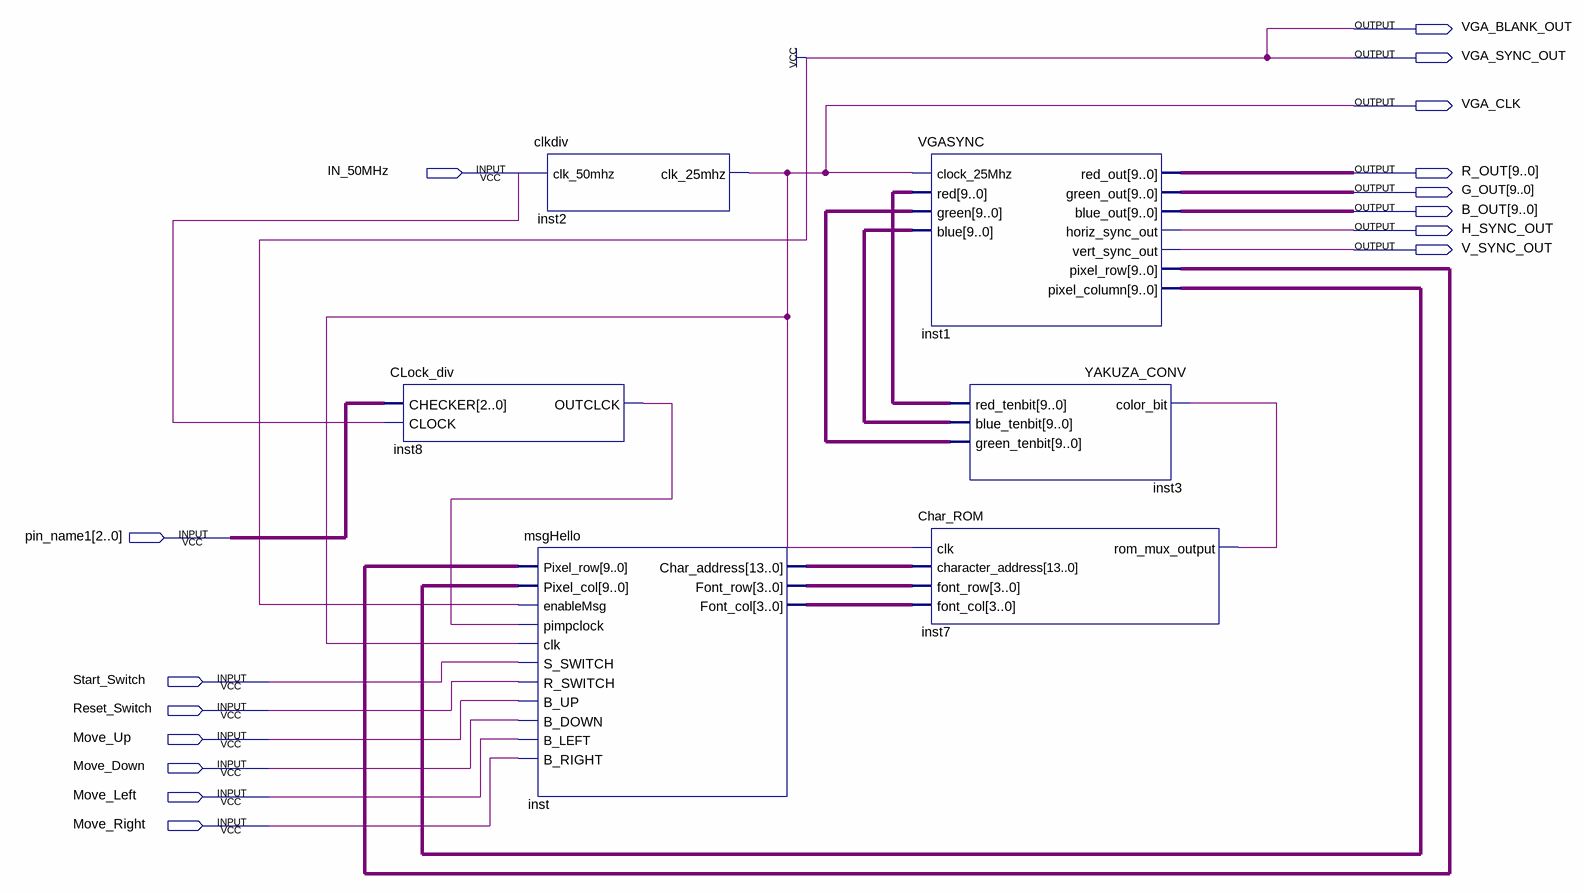
[diagram p0: schematic sheet]
// Quartus schematic vgaA.bdf as structural Verilog: 6 symbols, 16 pins
module vgaA (
  input  IN_50MHz,
  input  [2:0] pin_name1,
  input  Start_Switch,
  input  Reset_Switch,
  input  Move_Up,
  input  Move_Down,
  input  Move_Left,
  input  Move_Right,
  output VGA_BLANK_OUT,
  output VGA_SYNC_OUT,
  output VGA_CLK,
  output [9:0] R_OUT,
  output [9:0] G_OUT,
  output [9:0] B_OUT,
  output H_SYNC_OUT,
  output V_SYNC_OUT
);

  wire inst7_rom_mux_output, inst8_outclck;
  wire [3:0] inst_font_col, inst_font_row;
  wire [9:0] inst1_pixel_column, inst1_pixel_row, inst3_blue_tenbit, inst3_green_tenbit, inst3_red_tenbit;
  wire [13:0] inst_char_address;

  CLock_div inst8 (.CHECKER(pin_name1), .CLOCK(IN_50MHz), .OUTCLCK(inst8_outclck));
  clkdiv inst2 (.clk_50mhz(IN_50MHz), .clk_25mhz(VGA_CLK));
  msgHello inst (
    .Pixel_row(inst1_pixel_row), .Pixel_col(inst1_pixel_column), .enableMsg(1'b1), .pimpclock(inst8_outclck),
    .clk(VGA_CLK), .S_SWITCH(Start_Switch), .R_SWITCH(Reset_Switch), .B_UP(Move_Up), .B_DOWN(Move_Down),
    .B_LEFT(Move_Left), .B_RIGHT(Move_Right), .Char_address(inst_char_address), .Font_row(inst_font_row),
    .Font_col(inst_font_col));
  VGASYNC inst1 (
    .clock_25Mhz(VGA_CLK), .red(inst3_red_tenbit), .green(inst3_green_tenbit), .blue(inst3_blue_tenbit),
    .red_out(R_OUT), .green_out(G_OUT), .blue_out(B_OUT), .horiz_sync_out(H_SYNC_OUT),
    .vert_sync_out(V_SYNC_OUT), .pixel_row(inst1_pixel_row), .pixel_column(inst1_pixel_column));
  Char_ROM inst7 (
    .clk(VGA_CLK), .character_address(inst_char_address), .font_row(inst_font_row), .font_col(inst_font_col),
    .rom_mux_output(inst7_rom_mux_output));
  YAKUZA_CONV inst3 (
    .color_bit(inst7_rom_mux_output), .red_tenbit(inst3_red_tenbit), .blue_tenbit(inst3_blue_tenbit),
    .green_tenbit(inst3_green_tenbit));

  assign VGA_BLANK_OUT = 1'b1;
  assign VGA_SYNC_OUT = 1'b1;
endmodule
